# EAGLE design driver (EAGLE 5.06)
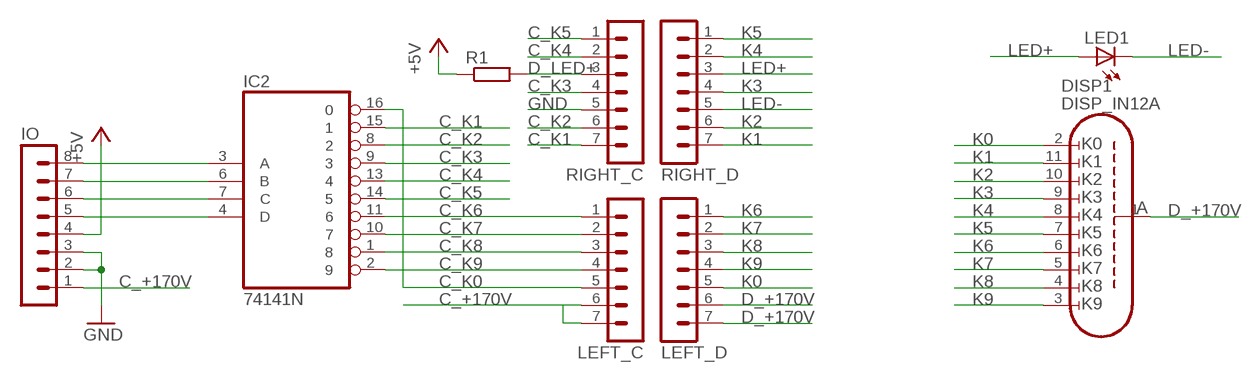
[diagram p0: schematic, sheet 1]

## Parts
DISP1  DISP_IN12A  [DISP_IN-12_SOCKET]
IC2  74141N  [DIL16]
IO  MA08-1  [MA08-1]
LED1  LED3MM  [LED3MM]
LEFT_C  MA07-1  [MA07-1]
LEFT_D  MA07-1  [MA07-1]
R1  R-EU_0204/7  [0204/7]
RIGHT_C  MA07-1  [MA07-1]
RIGHT_D  MA07-1  [MA07-1]

## Nets
+5V: IO.4 R1.1
C_+170V: IO.1 LEFT_C.6 LEFT_C.7
C_K0: IC2.16 LEFT_C.5
C_K1: IC2.15 RIGHT_C.7
C_K2: IC2.8 RIGHT_C.6
C_K3: IC2.9 RIGHT_C.4
C_K4: IC2.13 RIGHT_C.2
C_K5: IC2.14 RIGHT_C.1
C_K6: IC2.11 LEFT_C.1
C_K7: IC2.10 LEFT_C.2
C_K8: IC2.1 LEFT_C.3
C_K9: IC2.2 LEFT_C.4
D_+170V: DISP1.1(ANODE) LEFT_D.6 LEFT_D.7
D_LED+: R1.2 RIGHT_C.3
GND: IO.2 IO.3 RIGHT_C.5
K0: DISP1.2(K0) LEFT_D.5
K1: DISP1.11(K1) RIGHT_D.7
K2: DISP1.10(K2) RIGHT_D.6
K3: DISP1.9(K3) RIGHT_D.4
K4: DISP1.8(K4) RIGHT_D.2
K5: DISP1.7(K5) RIGHT_D.1
K6: DISP1.6(K6) LEFT_D.1
K7: DISP1.5(K7) LEFT_D.2
K8: DISP1.4(K8) LEFT_D.3
K9: DISP1.3(K9) LEFT_D.4
LED+: LED1.A RIGHT_D.3
LED-: LED1.K(C) RIGHT_D.5
N$1: IC2.4(D) IO.5
N$2: IC2.7(C) IO.6
N$3: IC2.6(B) IO.7
N$4: IC2.3(A) IO.8

## Power pins joined to a net without a drawn wire
GND: IC2.12(GND)
VCC: IC2.5(VCC)

## Library data of the parts
DISP1 = dp_devices:DISP_IN12A: IN-12A Nixie Display
IC2 = 74xx-eu:74*141: BCD to decimal DECODER/DRIVER
IO = con-lstb:MA08-1: PIN HEADER
LED1 = led:LED: LED OSRAM: - CHIPLED LG R971, LG N971, LY N971, LG Q971, LY Q971, LO R971, LY R971 LH N974, LH R974 LS Q976, LO Q976, LY Q976 LO Q996 - Hyper CHIPLED LW Q18S LB Q993, LB Q99A, LB R99A - SideLED LS A670, LO A670, LY A670, LG A670, LP A670 LB A673, LV A673, LT A673, LW A673 LH A674 LY A675 LS A676, LA A676, LO A676, LY A676, LW A676 LS A679, LY A679, LG A679 - Hyper Micro SIDELED® LS Y876, LA Y876, LO Y876, LY Y876 LT Y87S - SmartLED LW L88C, LW L88S LB L89C, LB L89S, LG L890 LS L89K, LO L89K, LY L89K LS L896, LA L896, LO L896, LY L896 - TOPLED LS T670, LO T670, LY T670, LG T670, LP T670 LSG T670, LSP T670, LSY T670, LOP T670, LYG T670 LG T671, LOG T671, LSG T671 LB T673, LV T673, LT T673, LW T673 LH T674 LS T676, LA T676, LO T676, LY T676, LB T676, LH T676, LSB T676, LW T676 LB T67C, LV T67C, LT T67C, LS T67K, LO T67K, LY T67K, LW E67C LS E67B, LA E67B, LO E67B, LY E67B, LB E67C, LV E67C, LT E67C LW T67C LS T679, LY T679, LG T679 LS T770, LO T770, LY T770, LG T770, LP T770 LB T773, LV T773, LT T773, LW T773 LH T774 LS E675, LA E675, LY E675, LS T675 LS T776, LA T776, LO T776, LY T776, LB T776 LHGB T686 LT T68C, LB T68C - Hyper Mini TOPLED® LB M676 - Mini TOPLED Santana® LG M470 LS M47K, LO M47K, LY M47K Source: http://www.osram.convergy.de LUXEON: - LUMILED® LXK2-PW12-R00, LXK2-PW12-S00, LXK2-PW14-U00, LXK2-PW14-V00 LXK2-PM12-R00, LXK2-PM12-S00, LXK2-PM14-U00 LXK2-PE12-Q00, LXK2-PE12-R00, LXK2-PE12-S00, LXK2-PE14-T00, LXK2-PE14-U00 LXK2-PB12-K00, LXK2-PB12-L00, LXK2-PB12-M00, LXK2-PB14-N00, LXK2-PB14-P00, LXK2-PB14-Q00 LXK2-PR12-L00, LXK2-PR12-M00, LXK2-PR14-Q00, LXK2-PR14-R00 LXK2-PD12-Q00, LXK2-PD12-R00, LXK2-PD12-S00 LXK2-PH12-R00, LXK2-PH12-S00 LXK2-PL12-P00, LXK2-PL12-Q00, LXK2-PL12-R00 Source: www.luxeon.com KINGBRIGHT: KA-3528ASYC Source: www.kingbright.com
LEFT_C LEFT_D RIGHT_C RIGHT_D = con-lstb:MA07-1: PIN HEADER
R1 = rcl:R-EU_: RESISTOR, European symbol

## Board
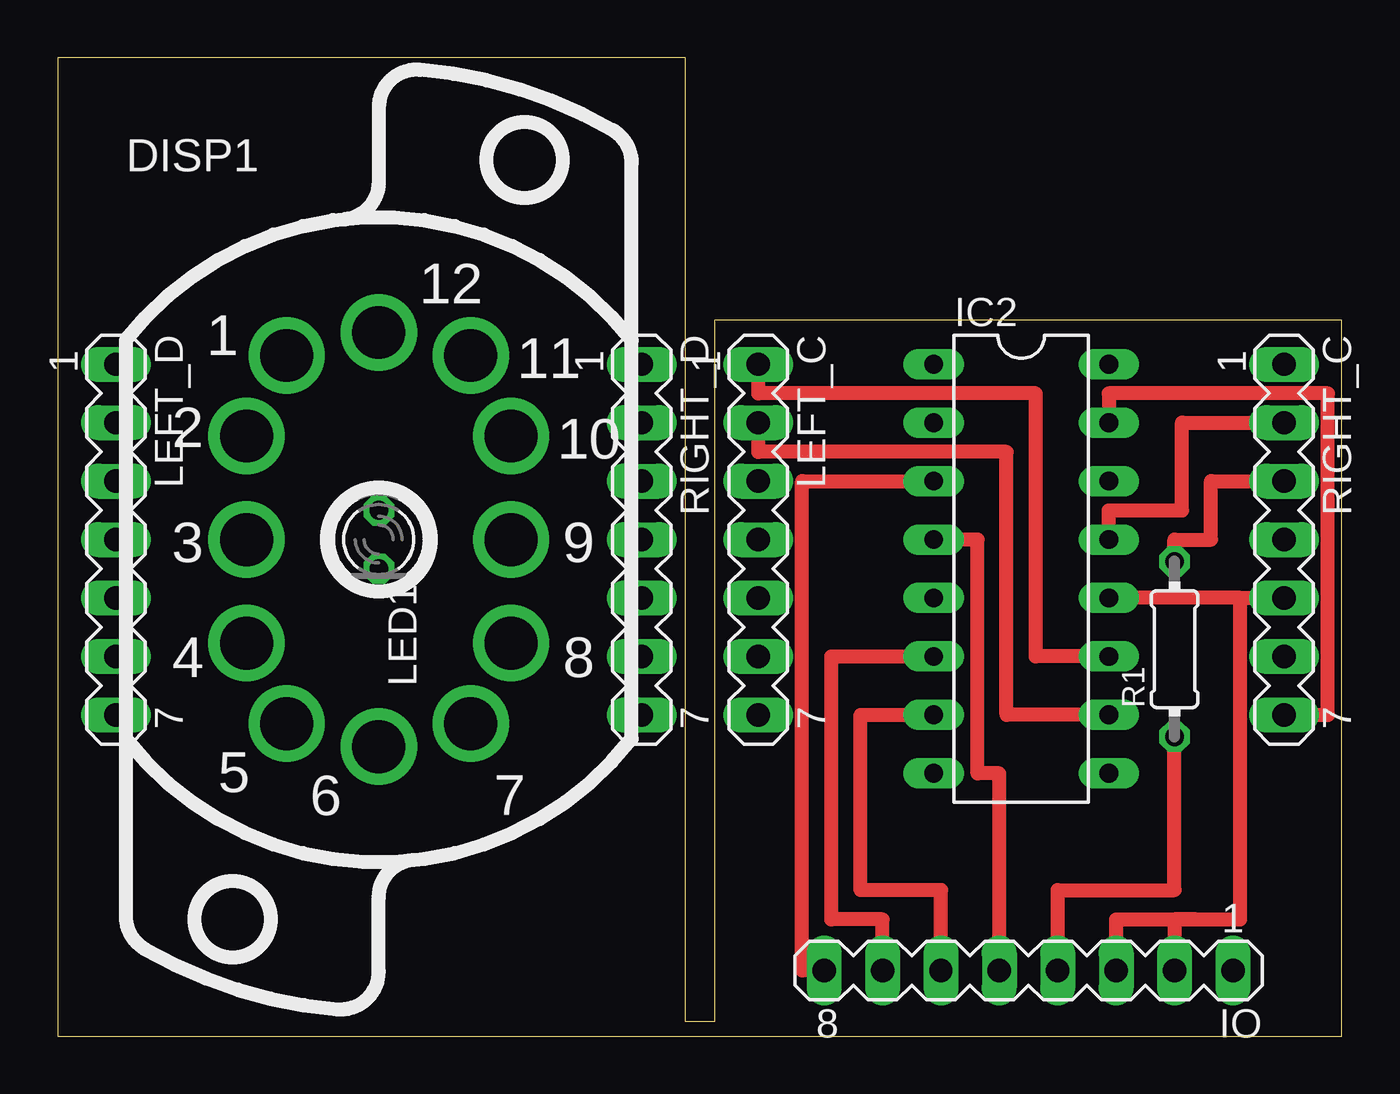
[diagram p1: board, top side]
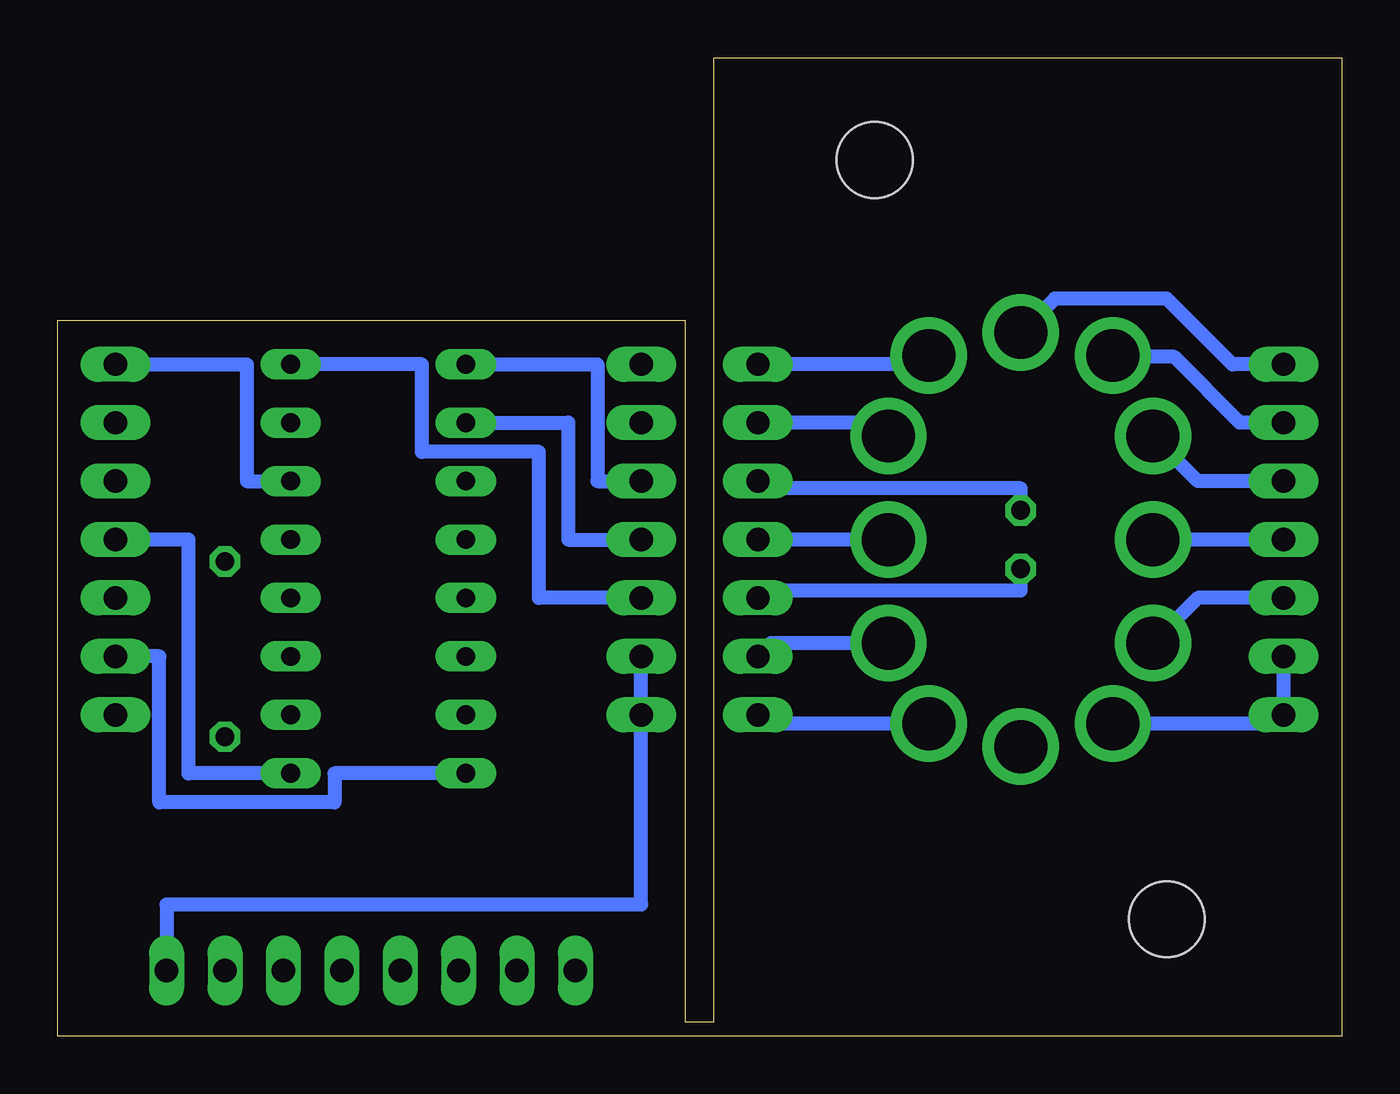
[diagram p2: board, bottom side, seen from below]

Size 55.86 x 42.55 mm. Coordinates in mm from the lower left corner, seen from the top.
Outline: 0,0 55.86,0 55.86,31.11 28.57,31.11 28.57,0.64 27.3,0.64 27.3,42.55 0,42.55 0,0
Copper layers (1*16): Top 0.035mm / dielectric 1.5mm / Bottom 0.035mm
Design rules "default": minimum track width 10mil, minimum drill 24mil, track to track 8mil, track to pad 8mil, pad to pad 8mil, via to via 8mil, smd to smd 8mil, copper to edge 40mil, drill to drill 8mil, minimum pad ring 10mil, minimum via ring 8mil, stop-mask expansion 4mil, vias tented up to drill 0mil, thermal gap 10mil

### Footprints (pad centres in the part's own frame; a part is rotated, then mirrored left to right if it is on the bottom)
DISP_IN-12_SOCKET = drill 2.3 round: 1 -4,-8; 2 -5.75,-4.5; 3 -5.75,0; 4 -5.75,4.5; 5 -4,8; 6 0,9; 7 4,8; 8 5.75,4.5; 9 5.75,0; 10 5.75,-4.5; 11 4,-8; 12 0,-9 | hole 3.3: 6.35,16.5; -6.35,-16.5
DIL16 = drill 0.813 long: 1 -8.89,-3.81; 2 -6.35,-3.81; 3 -3.81,-3.81; 4 -1.27,-3.81; 5 1.27,-3.81; 6 3.81,-3.81; 7 6.35,-3.81; 8 8.89,-3.81; 9 8.89,3.81; 10 6.35,3.81; 11 3.81,3.81; 12 1.27,3.81; 13 -1.27,3.81; 14 -3.81,3.81; 15 -6.35,3.81; 16 -8.89,3.81
MA08-1 = drill 1.016 long: 1 -8.89,0; 2 -6.35,0; 3 -3.81,0; 4 -1.27,0; 5 1.27,0; 6 3.81,0; 7 6.35,0; 8 8.89,0
LED3MM = drill 0.813 octagon: A -1.27,0; K 1.27,0
MA07-1 = drill 1.016 long: 1 -7.62,0; 2 -5.08,0; 3 -2.54,0; 4 0,0; 5 2.54,0; 6 5.08,0; 7 7.62,0
0204/7 = drill 0.813 octagon: 1 -3.81,0; 2 3.81,0

### Placement (x,y rotation side)
DISP1  13.97,21.59 0 top
IC2  41.91,20.32 270 top
IO  42.23,2.86 180 top
LED1  13.97,21.59 270 top
LEFT_C  30.48,21.59 270 top
LEFT_D  2.54,21.59 270 top
R1  48.58,16.83 90 top
RIGHT_C  53.34,21.59 270 top
RIGHT_D  25.4,21.59 270 top

### Tracks (layer width: path | path; a pad name or v marks a point on that pad's centre or on a via)
+5V
  Top 0.61: R1.1 48.58,6.35 43.5,6.35 IO.4
C_+170V
  Bottom 0.61: IO.1 51.12,5.71 30.48,5.71 LEFT_C.7 LEFT_C.6
C_K0
  Bottom 0.61: LEFT_C.5 34.92,19.05 34.92,25.4 40.01,25.4 40.01,29.21 IC2.16
C_K1
  Top 0.61: RIGHT_C.7 55.24,13.97 55.24,27.94 45.72,27.94 IC2.15
C_K2
  Bottom 0.61: IC2.8 43.81,11.43 43.81,10.16 51.44,10.16 51.44,16.51 RIGHT_C.6
C_K3
  Bottom 0.61: IC2.9 50.16,11.43 50.16,21.59 RIGHT_C.4
C_K4
  Top 0.61: IC2.13 45.72,22.86 48.9,22.86 48.9,26.67 RIGHT_C.2
C_K5
  Bottom 0.61: RIGHT_C.1 47.62,29.21 47.62,24.13 IC2.14
C_K6
  Top 0.61: IC2.11 42.55,16.51 42.55,27.94 30.48,27.94 LEFT_C.1
C_K7
  Top 0.61: IC2.10 41.27,13.97 41.27,25.4 30.48,25.4 LEFT_C.2
C_K8
  Bottom 0.61: IC2.1 32.38,29.21 32.38,24.13 LEFT_C.3
C_K9
  Bottom 0.61: IC2.2 33.66,26.67 33.66,21.59 LEFT_C.4
D_+170V
  Bottom 0.61: DISP1.1 2.92,13.59 LEFT_D.7 LEFT_D.6
D_LED+
  Top 0.61: R1.2 48.58,21.59 50.16,21.59 50.16,24.13 RIGHT_C.3
GND
  Top 0.61: 51.44,19.05 IC2.12 | 51.44,19.05 RIGHT_C.5 | IO.3 46.04,5.08 49.53,5.08 | 49.53,5.08 51.44,5.08 51.44,19.05 | IO.2 48.58,5.08 49.53,5.08
K0
  Bottom 0.61: LEFT_D.5 6.26,19.05 DISP1.2
K1
  Bottom 0.61: DISP1.11 25.02,13.59 RIGHT_D.7
K2
  Bottom 0.61: DISP1.10 24.82,17.09 RIGHT_D.6
K3
  Bottom 0.61: DISP1.9 RIGHT_D.4
K4
  Bottom 0.61: RIGHT_D.2 20.3,26.67 DISP1.8
K5
  Bottom 0.61: RIGHT_D.1 18.35,29.21 DISP1.7
K6
  Bottom 0.61: LEFT_D.1 4.76,29.21 7.62,32.07 12.49,32.07 DISP1.6
K7
  Bottom 0.61: LEFT_D.2 4.45,26.67 7.3,29.53 9.91,29.53 DISP1.5
K8
  Bottom 0.61: LEFT_D.3 6.26,24.13 DISP1.4
K9
  Bottom 0.61: LEFT_D.4 DISP1.3
LED+
  Bottom 0.61: LED1.A 13.97,23.81 25.08,23.81 RIGHT_D.3
LED-
  Bottom 0.61: LED1.K 13.97,19.37 25.08,19.37 RIGHT_D.5
N$1
  Top 0.61: IO.5 40.96,11.43 40.01,11.43 40.01,21.59 IC2.4
N$2
  Top 0.61: IO.6 38.42,6.35 34.92,6.35 34.92,13.97 IC2.7
N$3
  Top 0.61: IO.7 35.88,5.08 33.66,5.08 33.66,16.51 IC2.6
N$4
  Top 0.61: IO.8 32.38,2.86 32.38,24.13 IC2.3